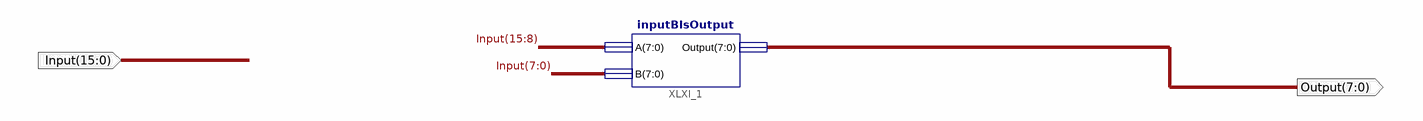
[diagram p0: schematic sheet 1]
// Xilinx ISE schematic outPutFirstEightBits.sch (spartan6) as structural Verilog: 1 symbols, 2 ports
module outPutFirstEightBits (
  input  [15:0] Input,
  output [7:0] Output
);

  inputBIsOutput XLXI_1 (.A(Input[15:8]), .B(Input[7:0]), .Output(Output));
endmodule
